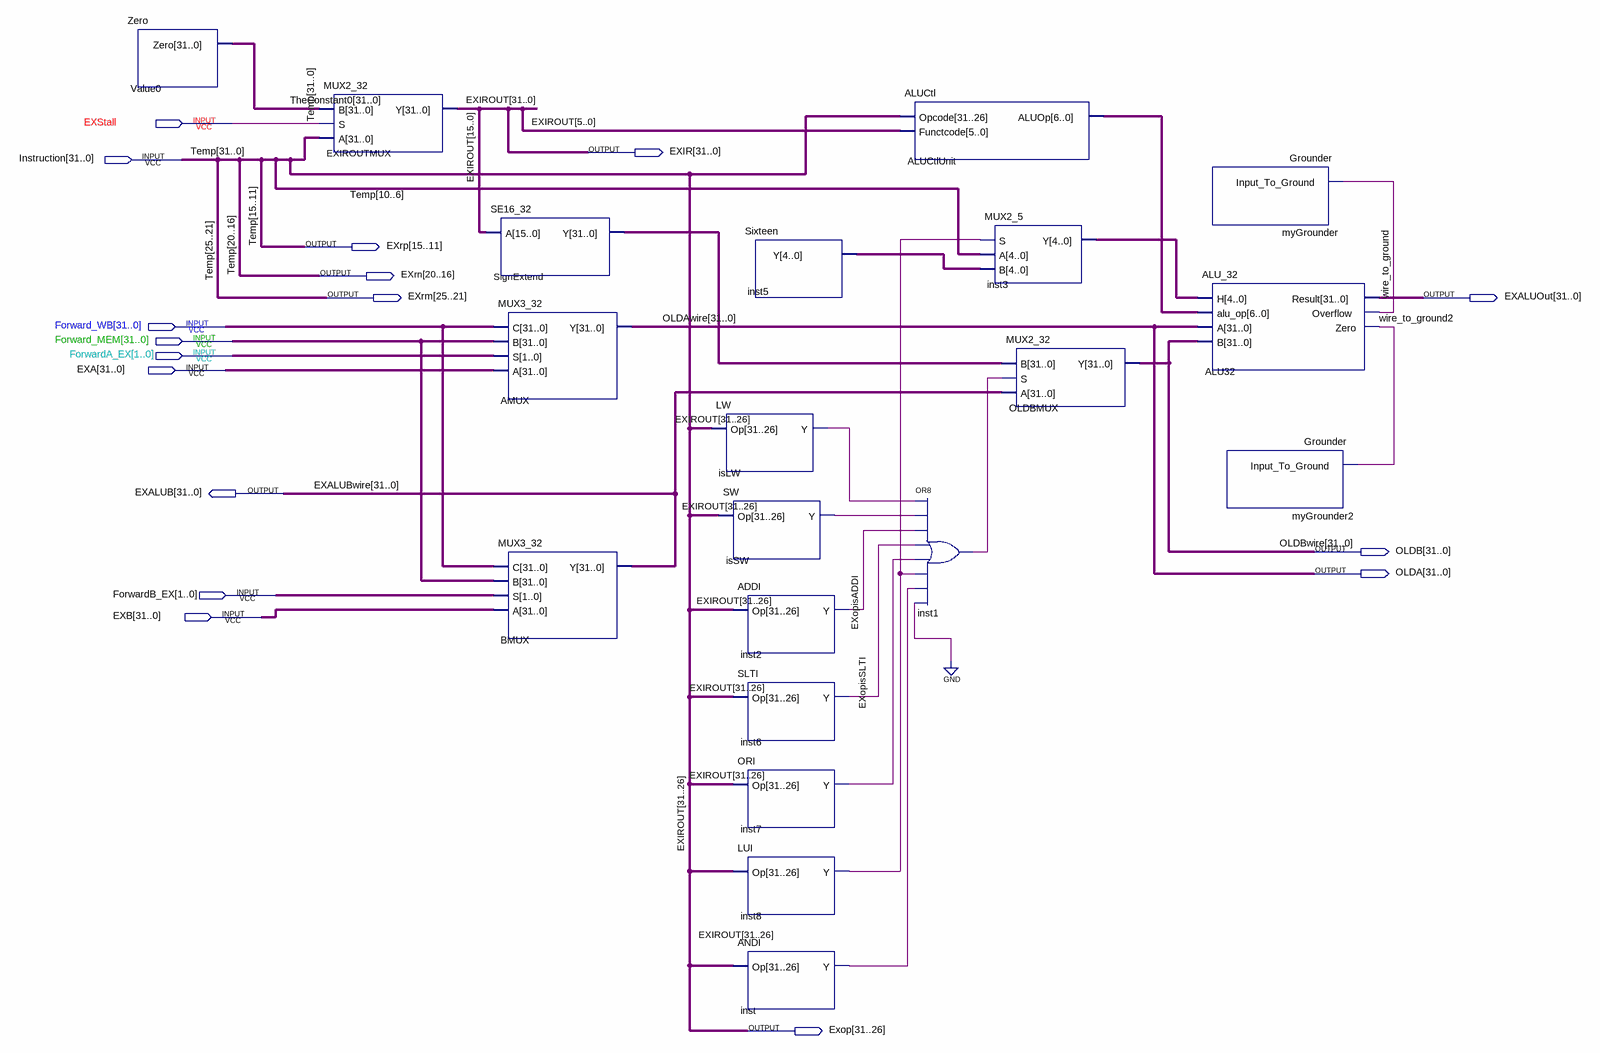
[diagram p0: schematic sheet]
// Quartus schematic EX.bdf as structural Verilog: 20 symbols, 17 pins
module EX (
  input  EXStall,
  input  [31:0] Instruction,
  input  [31:0] Forward_WB,
  input  [31:0] Forward_MEM,
  input  [1:0] ForwardA_EX,
  input  [31:0] EXA,
  input  [1:0] ForwardB_EX,
  input  [31:0] EXB,
  output [31:0] EXIR,
  output [15:11] EXrp,
  output [20:16] EXrn,
  output [25:21] EXrm,
  output [31:0] EXALUOut,
  output [31:0] EXALUB,
  output [31:0] OLDB,
  output [31:0] OLDA,
  output [31:26] Exop
);

  wire EXopisADDI, EXopisSLTI, inst1_out, inst7_y, inst8_y, inst_y, isLW_y, isSW_y, wire_to_ground,
       wire_to_ground2;
  wire [4:0] inst3_y, inst5_y;
  wire [6:0] ALUCtlUnit_aluop;
  wire [31:0] SignExtend_y, TheConstant0;

  Zero Value0 (.Zero(TheConstant0));
  MUX2_32 EXIROUTMUX (.B(TheConstant0), .S(EXStall), .A(Instruction), .Y(EXIR));
  SE16_32 SignExtend (.A(EXIR[15:0]), .Y(SignExtend_y));
  MUX3_32 AMUX (.C(Forward_WB), .B(Forward_MEM), .S(ForwardA_EX), .A(EXA), .Y(OLDA));
  MUX3_32 BMUX (.C(Forward_WB), .B(Forward_MEM), .S(ForwardB_EX), .A(EXB), .Y(EXALUB));
  Sixteen inst5 (.Y(inst5_y));
  LW isLW (.Op(EXIR[31:26]), .Y(isLW_y));
  SW isSW (.Op(EXIR[31:26]), .Y(isSW_y));
  ADDI inst2 (.Op(EXIR[31:26]), .Y(EXopisADDI));
  SLTI inst6 (.Op(EXIR[31:26]), .Y(EXopisSLTI));
  ORI inst7 (.Op(EXIR[31:26]), .Y(inst7_y));
  LUI inst8 (.Op(EXIR[31:26]), .Y(inst8_y));
  ANDI inst (.Op(EXIR[31:26]), .Y(inst_y));
  ALUCtl ALUCtlUnit (.Opcode(Instruction), .Functcode(EXIR[5:0]), .ALUOp(ALUCtlUnit_aluop));
  or inst1 (inst1_out, isLW_y, isSW_y, EXopisADDI, EXopisSLTI, inst7_y, inst8_y, inst_y, 1'b0);
  MUX2_5 inst3 (.S(inst8_y), .A(Instruction[10:6]), .B(inst5_y), .Y(inst3_y));
  MUX2_32 OLDBMUX (.B(SignExtend_y), .S(inst1_out), .A(EXALUB), .Y(OLDB));
  Grounder myGrounder (.Input_To_Ground(wire_to_ground));
  ALU_32 ALU32 (
    .H(inst3_y), .alu_op(ALUCtlUnit_aluop), .A(OLDA), .B(OLDB), .Result(EXALUOut), .Overflow(wire_to_ground),
    .Zero(wire_to_ground2));
  Grounder myGrounder2 (.Input_To_Ground(wire_to_ground2));

  assign Exop = EXIR[31:26];
  assign EXrm = Instruction[25:21];
  assign EXrn = Instruction[20:16];
  assign EXrp = Instruction[15:11];

  // Other names for the same wires on the sheet: EXALUBwire[31:0] = EXALUB; EXIROUT[31:0] = EXIR;
  //   Temp[31:0] = Instruction; OLDAwire[31:0] = OLDA; OLDBwire[31:0] = OLDB
endmodule
